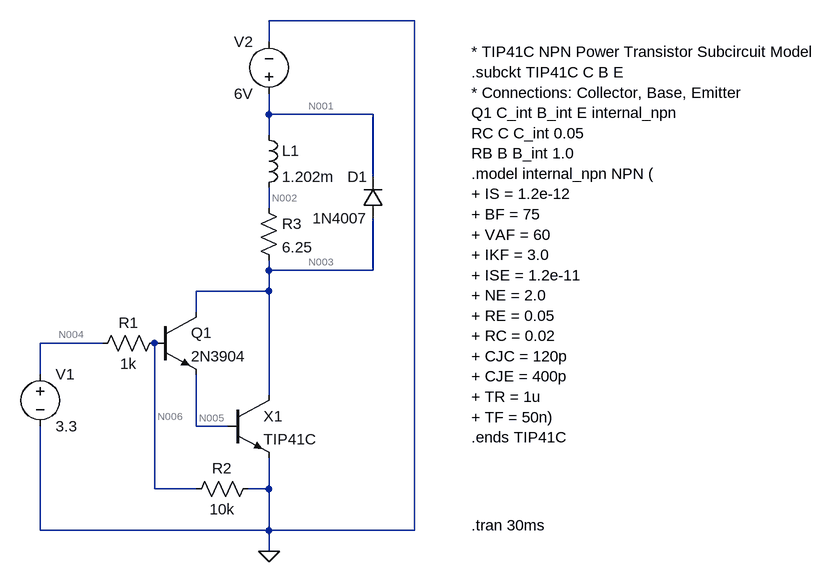
[diagram p0: schematic Skripsie Spice model.asc]
Skripsie Spice model.asc, the LTspice schematic file:
Version 4.1
SHEET 1 1364 680
WIRE 704 -400 480 -400
WIRE 480 -368 480 -400
WIRE 480 -256 480 -288
WIRE 640 -256 480 -256
WIRE 480 -224 480 -256
WIRE 640 -160 640 -256
WIRE 480 -112 480 -144
WIRE 480 -16 480 -32
WIRE 640 -16 640 -96
WIRE 640 -16 480 -16
WIRE 480 16 480 -16
WIRE 480 16 368 16
WIRE 368 48 368 16
WIRE 224 96 128 96
WIRE 128 144 128 96
WIRE 480 176 480 16
WIRE 368 224 368 144
WIRE 416 224 368 224
WIRE 304 320 304 96
WIRE 368 320 304 320
WIRE 480 320 480 272
WIRE 480 320 448 320
WIRE 128 384 128 224
WIRE 480 384 480 320
WIRE 480 384 128 384
WIRE 704 384 704 -400
WIRE 704 384 480 384
WIRE 480 416 480 384
FLAG 480 416 0
SYMBOL voltage 128 128 R0
SYMATTR InstName V1
SYMATTR Value 3.3
SYMBOL res 320 80 R90
WINDOW 0 0 56 VBottom 2
WINDOW 3 32 56 VTop 2
SYMATTR InstName R1
SYMATTR Value 1k
SYMBOL npn 304 48 R0
SYMATTR InstName Q1
SYMATTR Value 2N3904
SYMBOL npn 416 176 R0
SYMATTR InstName X1
SYMATTR Value TIP41C
SYMATTR Prefix X
SYMBOL res 464 304 R90
WINDOW 0 0 56 VBottom 2
WINDOW 3 32 56 VTop 2
SYMATTR InstName R2
SYMATTR Value 10k
SYMBOL res 464 -128 R0
SYMATTR InstName R3
SYMATTR Value 6.25
SYMBOL ind 464 -240 R0
SYMATTR InstName L1
SYMATTR Value 1.202m
SYMBOL voltage 480 -272 R180
WINDOW 0 24 96 Left 2
WINDOW 3 24 16 Left 2
SYMATTR InstName V2
SYMATTR Value 6V
SYMBOL diode 656 -96 R180
WINDOW 0 24 64 Left 2
WINDOW 3 24 0 Left 2
SYMATTR InstName D1
SYMATTR Value 1N4007
TEXT 792 376 Left 2 !.tran 30ms
TEXT 792 -352 Left 2 !* TIP41C NPN Power Transistor Subcircuit Model\n.subckt TIP41C C B E\n* Connections: Collector, Base, Emitter\nQ1 C_int B_int E internal_npn\nRC C C_int 0.05\nRB B B_int 1.0\n.model internal_npn NPN (\n+ IS = 1.2e-12\n+ BF = 75\n+ VAF = 60\n+ IKF = 3.0\n+ ISE = 1.2e-11\n+ NE = 2.0\n+ RE = 0.05\n+ RC = 0.02\n+ CJC = 120p\n+ CJE = 400p\n+ TR = 1u\n+ TF = 50n)\n.ends TIP41C

The netlist it stands for:
* Skripsie Spice model.asc
V1 N004 0 3.3
R1 N006 N004 1k
Q1 N003 N006 N005 0 2N3904
X§X1 N003 N005 0 TIP41C  ; pins C B E
R2 0 N006 10k
R3 N002 N003 6.25
L1 N001 N002 1.202m
V2 N001 0 6V
D1 N003 N001 1N4007
.model D D
.lib standard.dio
.model NPN NPN
.model PNP PNP
.lib standard.bjt
.tran 30ms
* TIP41C NPN Power Transistor Subcircuit Model
.subckt TIP41C C B E
* Connections: Collector, Base, Emitter
Q1 C_int B_int E internal_npn
RC C C_int 0.05
RB B B_int 1.0
.model internal_npn NPN (
+ IS = 1.2e-12
+ BF = 75
+ VAF = 60
+ IKF = 3.0
+ ISE = 1.2e-11
+ NE = 2.0
+ RE = 0.05
+ RC = 0.02
+ CJC = 120p
+ CJE = 400p
+ TR = 1u
+ TF = 50n)
.ends TIP41C
.backanno
.end

* Results of the author's LTspice run, read from the files saved beside the schematic
* Operating Point, zero values left out:
*   V(n006) = 1.534 V
*   V(n005) = 766.7 mV
*   V(n002) = 5.999 V
*   V(n004) = 3.3 V
*   V(n003) = 800.7 mV
*   V(n001) = 6 V
*   I(V1) = -1.766 mA
*   Ic(Q1) = 12.31 mA
*   Ib(Q1) = 1.613 mA
*   Ie(Q1) = -13.92 mA
*   I(R3) = 831.8 mA
*   I(D1) = -95.2 pA
*   I(R2) = -153.4 µA
*   I(R1) = -1.766 mA
*   I(L1) = 831.8 mA
*   I(V2) = -831.8 mA
*   Ix(x1:c) = 819.4 mA
*   Ix(x1:b) = 13.92 mA
*   Ix(x1:e) = -833.4 mA